# Altium schematic sheet BH66F5242- Thermocouple.SchDoc
size A4
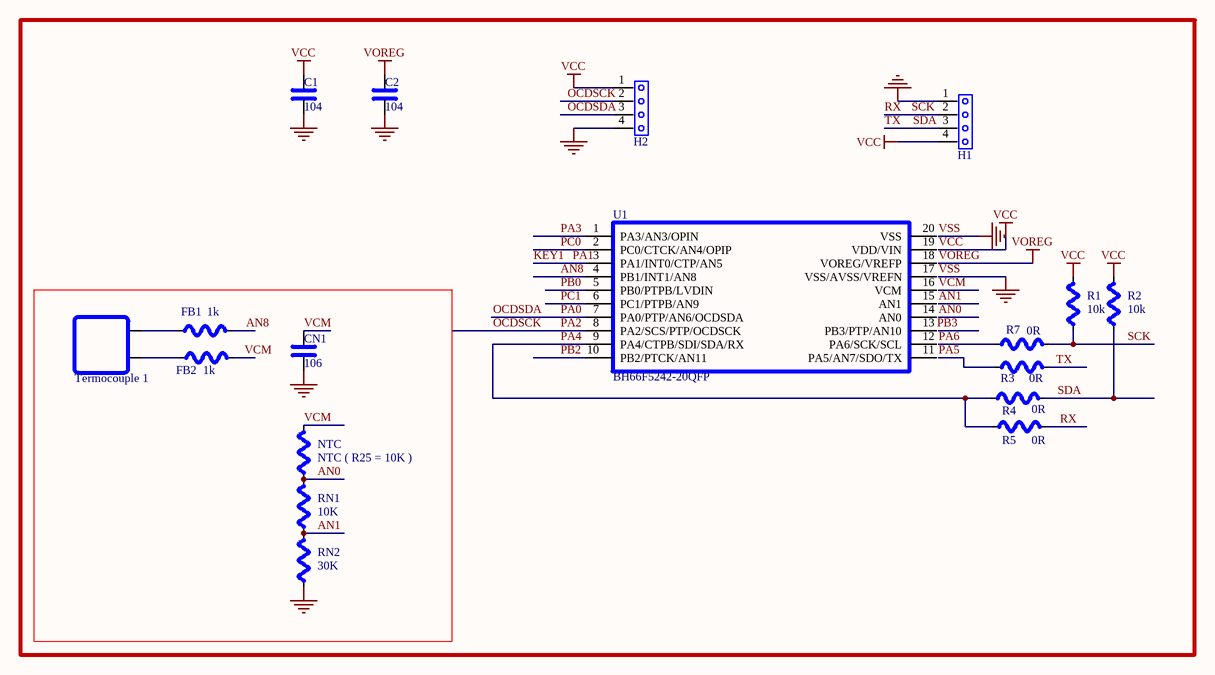
[diagram p0: BH66F5242- Thermocouple.SchDoc]

## Parts
C1  value 104  [C0603]  (hidden comment: CAP)
C2  value 104  [C0603]  (hidden comment: CAP)
CN1  value 106  [C0603]  (hidden comment: CAP)
FB1  value 1k  [R0603]  (hidden comment: RESISTOR)
FB2  value 1k  [R0603]  (hidden comment: RESISTOR)
H1  HEADER4  [SIP4_2.0MM]  (value not drawn)  (no BOM)
H2  HEADER4  [HDR1X4]  (value not drawn)  (no BOM)
NTC  Vaule: NTC ( R25 = 10K )  [R0603]  (hidden comment: RES)
R1  Vaule: 10k  [R0603]  (hidden comment: RES)
R2  Vaule: 10k  [R0603]  (hidden comment: RES)
R3  value 0R  [R0603]  (hidden comment: RESISTOR)
R4  value 0R  [R0603]  (hidden comment: RESISTOR)
R5  value 0R  [R0603]  (hidden comment: RESISTOR)
R7  value 0R  [R0603]  (hidden comment: RESISTOR)
RN1  Vaule: 10K  [R0603]  (hidden comment: RES)
RN2  Vaule: 30K  [R0603]  (hidden comment: RES)
Termocouple_1  CONNET*2  [KB396]  (value not drawn)  (no BOM)
U1  BH66F5242-20QFP  [QFN20(4*4)]

## Nets
VCC: C1.2 H1.4 H2.1 R1.2 R2.2
VOREG: C2.2
VSS: C1.1 C2.1 CN1.1 H1.1 H2.4 RN2.1  [also labelled GND]
AN0: NTC.1 RN1.2
AN1: RN1.1 RN2.2
AN8: FB1.2 U1.4(PB1/INT1/AN8)
KEY1: U1.3(PA1/INT0/CTP/AN5)  [also labelled PA1]
OCDSCK: H2.2 U1.8(PA2/SCS/PTP/OCDSCK)  [also labelled PA2]
OCDSDA: H2.3 U1.7(PA0/PTP/AN6/OCDSDA)  [also labelled PA0]
PA3: U1.1(PA3/AN3/OPIN)
PA4: R4.1 R5.1 U1.9(PA4/CTPB/SDI/SDA/RX)
PA5: R3.1
PA6: R7.1
PB0: U1.5(PB0/PTPB/LVDIN)
PB2: U1.10(PB2/PTCK/AN11)
PB3: U1.13(PB3/PTP/AN10)
PC0: U1.2(PC0/CTCK/AN4/OPIP)
PC1: U1.6(PC1/PTPB/AN9)
RX: H1.2 R1.1 R5.2 R7.2  [also labelled SCK]
SDA: H1.3 R2.1 R3.2 R4.2  [also labelled TX]
VCM: CN1.2 FB2.2 NTC.2
NetFB1_1: FB1.1 Termocouple_1.2
NetFB2_1: FB2.1 Termocouple_1.1

Not connected (* = marked no-connect by the designer): U1 11(PA5/AN7/SDO/TX) 12(PA6/SCK/SCL) 14(AN0) 15(AN1) 16(VCM) 17(VSS/AVSS/VREFN) 18(VOREG/VREFP) 19(VDD/VIN) 20(VSS)

## Library data of the parts
C1 C2 CN1 = C0603: 0603 CAPACITOR
NTC R1 R2 RN1 RN2 = R0603: 0603 RESISTOR
Termocouple_1 = CONNET*2: 2CONNET*2.54